# Altium schematic sheet Regulator.SchDoc
size A
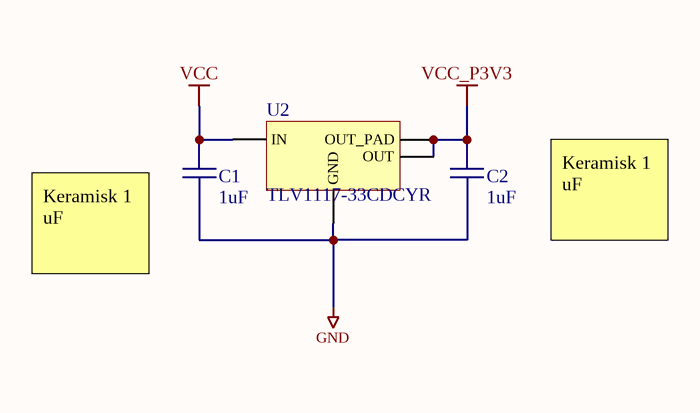
[diagram p0: Regulator.SchDoc]

## Parts
C1  1uF  [CAPC0805(2012)100_N]
C2  1uF  [CAPC0805(2012)100_N]
U2  TLV1117-33CDCYR  [SOT230P700X180-4N]

## Nets
GND: C1.1 C2.1 U2.1(GND)
VCC: C1.2 U2.3(IN)
VCC_P3V3: C2.2 U2.2(OUT_PAD) U2.4(OUT)

## Notes on the sheet
- (near C1) Keramisk 1 uF
- (near C2) Keramisk 1 uF

## Library data of the parts
C1 C2 = 3582: X7R 50V 10%; id: 3582; pakke_opprettet_av: 815; leverandor_varenr: 1735541; pris: 4; nokkelord: Kondensator, capacitor; produsent: Murata; leverandor: Farnell; pakketype: 0805; pakke_opprettet: 14-Nov-14 8:52:01 PM; symbol_opprettet_av: 815; symbol_opprettet: 14-Nov-14 8:19:34 PM; navn: 1uF
U2 = 2386: 3,3V Low dropout regulator; id: 2386; rad: 2; rom: OV; lager_type: Fremlager; dybde: 0; hylle: 9; antall: 63; pakke_opprettet_av: 774; leverandor_varenr: 2447986; pris: 5; nokkelord: ldo; produsent: Texas Instruments; leverandor: Farnell; pakketype: SOT; kolonne: 0; pakke_opprettet: 7/11/2014 10:00:23 PM; symbol_opprettet_av: 774; symbol_opprettet: 7/11/2014 10:01:42 PM; navn: TLV1117-33CDCYR